# Altium schematic sheet dcdc300_15&Fuente_dual_15V.SchDoc
size A3
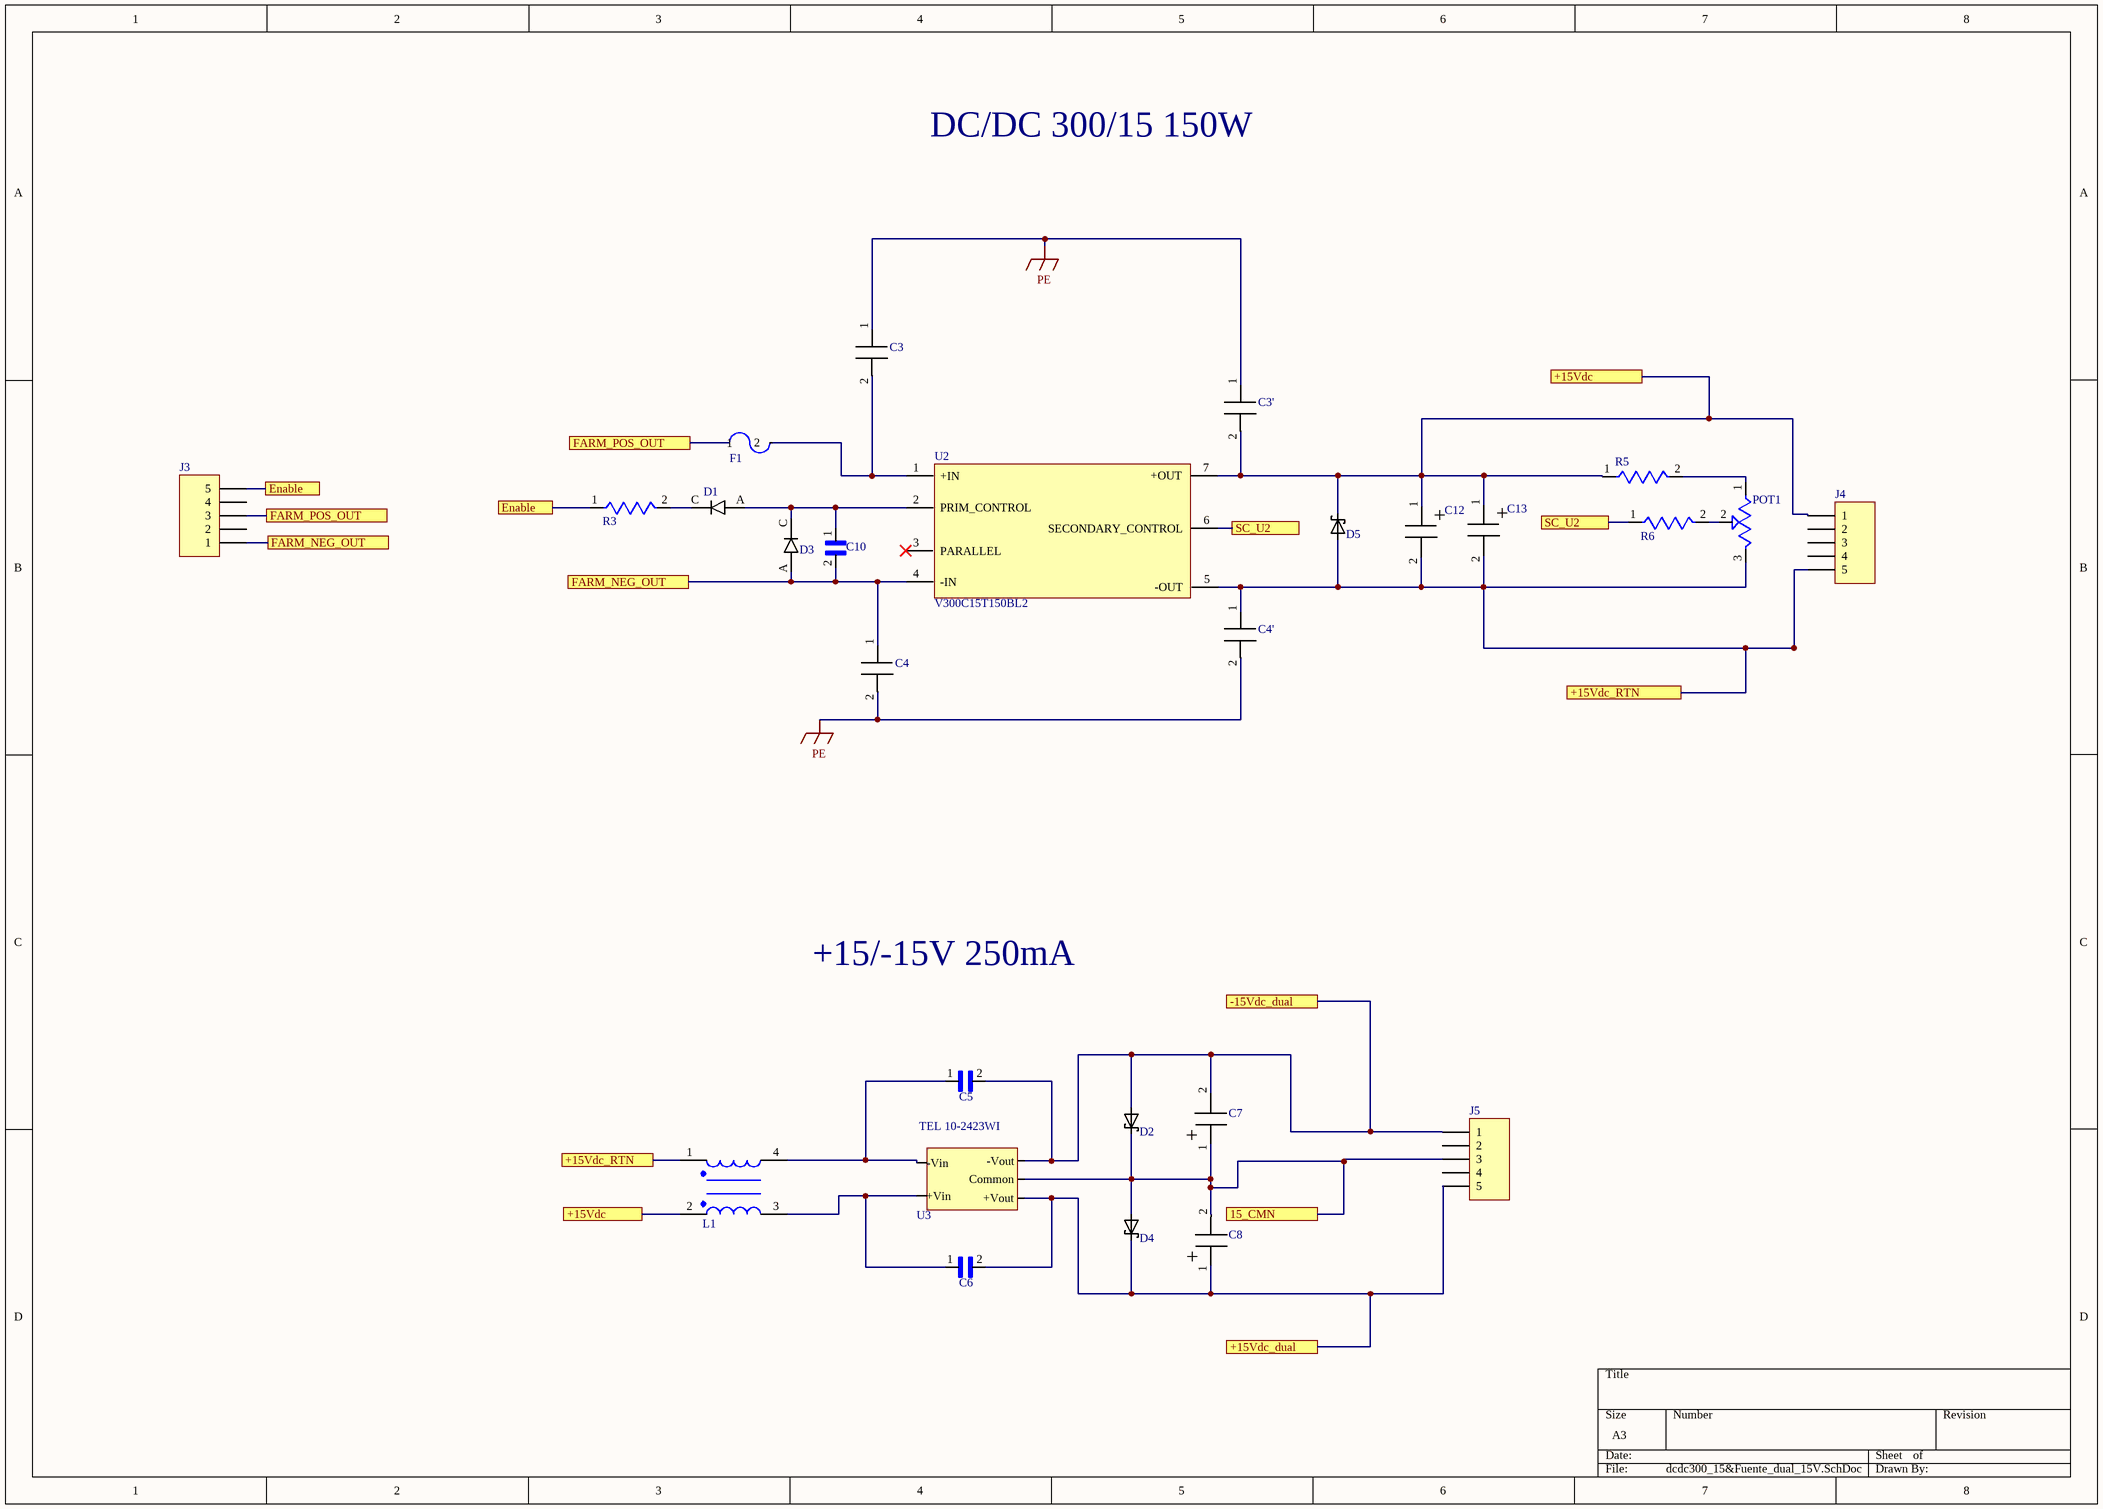
[diagram p0: dcdc300_15&Fuente_dual_15V.SchDoc]

## Parts
C3  01000  [Vicor 01000 Cap]  (value not drawn)
C3'  01000  [Vicor 01000 Cap]  (value not drawn)
C4  01000  [Vicor 01000 Cap]  (value not drawn)
C4'  01000  [Vicor 01000 Cap]  (value not drawn)
C5  1808GA101JAT1A  [MLCC SMD 1808 50V]  (value not drawn)
C6  1808GA101JAT1A  [MLCC SMD 1808 50V]  (value not drawn)
C7  EEE-FK1V100R  [PANASONIC FK SERIES]  (value not drawn)
C8  EEE-FK1V100R  [PANASONIC FK SERIES]  (value not drawn)
C10  UMF105B7102MVHF  [MLCC SMD 0402 50V]  (value not drawn)
C12  EEE-TK1V101P  [Panasonic TK series]  (value not drawn)
C13  EEE-TK1V101P  [Panasonic TK series]  (value not drawn)
D1  1N4006-E3/54  [DO-41]  (value not drawn)
D2  SMCJ15A  [TVS Diode DO-214AB-2 (SMC)]  (value not drawn)
D3  1N5817RLG  [DO-41]  (value not drawn)
D4  SMCJ15A  [TVS Diode DO-214AB-2 (SMC)]  (value not drawn)
D5  SMCJ15A  [TVS Diode DO-214AB-2 (SMC)]  (value not drawn)
F1  BK/PCB-3-R  [PCB-PCD Fuse Eaton]  (value not drawn)
J3  Header 5  [HDR1X5]  (value not drawn)
J4  Header 5  [HDR1X5]  (value not drawn)
J5  Header 5  [HDR1X5]  (value not drawn)
L1  744273222  [744273222]  (value not drawn)
POT1  3296X-1-102LF  [3296W]  (value not drawn)
R3  WHA250FET  [WHA Resistor]  (value not drawn)
R5  MF1/4DC1151F  [KOA MFS1/4 resistors]  (value not drawn)
R6  MF1/4DCT52R9311F  [KOA MF1/4 resistors]  (value not drawn)
U2  V300C15T150BL2  [V300C**T***BL2]
U3  TEL 10-2423WI  [TEL 10-2423WI]

## Ports
15_CMN, +15Vdc, +15Vdc_dual, +15Vdc_RTN, -15Vdc_dual, Enable, FARM_NEG_OUT, FARM_POS_OUT, SC_U2

## Nets
PE: C3.1 C3'.1 C4.2 C4'.2
15_CMN: C7.1 C8.2 D2.C D4.A J5.3 U3.8(Common) ; port 15_CMN
+15Vdc: C3'.2 C12.1 C13.1 D5.C J4.1 L1.2 R5.1(CCW) U2.7(+OUT) ; port +15Vdc
+15Vdc_dual: C6.2 C8.1 D4.C J5.5 U3.9(+Vout) ; port +15Vdc_dual
+15Vdc_RTN: C4'.1 C12.2 C13.2 D5.A J4.5 L1.1 POT1.3(CW) U2.5(-OUT) ; port +15Vdc_RTN
-15Vdc_dual: C5.2 C7.2 D2.A J5.1 U3.10(-Vout) ; port -15Vdc_dual
Enable: J3.5 R3.1(CCW) ; port Enable
FARM_NEG_OUT: C4.1 C10.2 D3.A J3.1 U2.4(-IN) ; port FARM_NEG_OUT
FARM_POS_OUT: F1.1 J3.3 ; port FARM_POS_OUT
SC_U2: R6.1(CCW) U2.6(SECONDARY_CONTROL) ; port SC_U2
NetC3_2: C3.2 F1.2 U2.1(+IN)
NetC5_1: C5.1 L1.4 U3.1(-Vin)
NetC6_1: C6.1 L1.3 U3.16(+Vin)
NetC10_1: C10.1 D1.A D3.C U2.2(PRIM_CONTROL)
NetD1_C: D1.C R3.2(CW)
NetPOT1_1: POT1.1(CCW) R5.2(CW)
NetPOT1_2: POT1.2(WIPER) R6.2(CW)

Not connected (* = marked no-connect by the designer): J3 2 4; J4 2 3 4; J5 2 4; U2 3(PARALLEL)*

## Notes on the sheet
- DC/DC 300/15 150W
- +15/-15V 250mA
- (in symbol Panasonic electrolitic cap) +
- (in symbol Panasonic electrolitic cap FK) +

## Library data of the parts
C3 C3' C4 C4' = Vicor 01000: Cap Film 250Vac 4700pF; ComponentLink1Description: 01000; ComponentLink1URL: https://www.mouser.es/ProductDetail/Vicor/01000?qs=sGAEpiMZZMuWWq7rhECaKfvknpKVOrJMQIoHOM%252Blhgk%3D
C5 C6 = MLCC - SMD 1808: 2KV 100pF C0G 1808 5%; ComponentLink1Description: 1808GA101JAT1A; ComponentLink1URL: https://www.mouser.es/ProductDetail/AVX/1808GA101JAT1A?qs=uXoVb1bFidQW%252BmL544imEA==
C7 C8 = Panasonic electrolitic cap FK: 10uF, 35V; ComponentLink1Description: EEE-FK1V100R; ComponentLink1URL: https://www.mouser.es/ProductDetail/Panasonic/EEE-FK1V100R?qs=%2Fha2pyFaduj%2FIt2M0EHCFH6KCxiBIGyUhvn03lKjROYI3CJTVtBsWg%3D%3D
C10 = MLCC- SMD/SMT: 0402 50V 1000pF 20%; ComponentLink1Description: UMF105B7102MVHF; ComponentLink1URL: https://www.mouser.es/ProductDetail/Taiyo-Yuden/UMF105B7102MVHF?qs=sGAEpiMZZMsh%252B1woXyUXj3%2F0vCYPokIksdT%252B3UPAP3Y%3D
C12 C13 = Panasonic electrolitic cap: 100uF, 35Vdc; ComponentLink1Description: EEE-TK1V101P; ComponentLink1URL: https://www.mouser.es/ProductDetail/Panasonic/EEE-TK1V101P?qs=sGAEpiMZZMtZ1n0r9vR22cS6GEbW2ftohEDRFgYA5M4%3D
D1 = Diodo Standard: Rectificadores Vr/800V Io/1A; ComponentLink1Description: 1N4006-E3/54; ComponentLink1URL: https://www.mouser.es/ProductDetail/Vishay-Semiconductors/1N4006-E3-54?qs=N4vtoAxH%2FSrsleYv417wqA%3D%3D
D2 D4 D5 = TVS SMCJxxA: SMC do-214AB-2; ComponentLink1Description: SMCJ15A; ComponentLink1URL: https://www.mouser.es/ProductDetail/Taiwan-Semiconductor/SMCJ15A?qs=sGAEpiMZZMvxHShE6Whpu8fatLI1nnJdRhHnBKQQd%2F4%3D
D3 = Diodo Standard: Diodos y rectificadores Schottky 1A 20V; ComponentLink1Description: 1N5817RLG; ComponentLink1URL: https://www.mouser.es/ProductDetail/ON-Semiconductor/1N5817RLG?qs=sGAEpiMZZMtQ8nqTKtFS%2FCKUxMvjsmGzOxc2t8Io3Tc%3D
F1 = PCB-PCD  Fuse: 3A, 250VAC; ComponentLink1Description: BK/PCB-3-R; ComponentLink1URL: https://www.mouser.es/ProductDetail/Bussmann-Eaton/BK-PCB-3-R?qs=sGAEpiMZZMsNIlwy3aAdUaDZNJYRjnIOAIrCwmRP80U%3D
J3-J5 = Header 5: Header, 5-Pin; LatestRevisionDate: 17-Jul-2002; LatestRevisionNote: Re-released for DXP Platform.; Publisher: Altium Limited
L1 = 744273222: CMC 30UH 1.4A 2LN 2.2 KOHM SMD; ComponentLink1Description: Datasheet; ComponentLink1URL: https://www.we-online.de/katalog/datasheet/744273222.pdf; ComponentLink2Description: 744273222; ComponentLink2URL: https://www.digikey.com/product-detail/en/w%C3%BCrth-elektronik/744273222/732-2961-2-ND/2625900
POT1 = 3296W: 1kOhm; ComponentLink1Description: 3296W; ComponentLink1URL: https://www.mouser.es/ProductDetail/Bourns/3296X-1-102LF?qs=sGAEpiMZZMvygUB3GLcD7sSg8po3Zpo39j0IRAy8iUQ%3D
R3 = Resistor bobinado: 0.5W 250 ohms 1%; ComponentLink1Description: WHA250FET; ComponentLink1URL: https://www.mouser.es/ProductDetail/Ohmite/WHA250FET?qs=sGAEpiMZZMtlubZbdhIBICsIiTQa2nvcChJCFP%2FmfdI%3D
R5 = KOA MFS1/4 resistors: 1,15kOhm; ComponentLink1Description: MF1/4DC1151F; ComponentLink1URL: https://www.mouser.es/ProductDetail/KOA-Speer/MF1-4DC1151F?qs=sGAEpiMZZMu61qfTUdNhG7WeLdaRvH9A9PYBQZY3Jro%3D
R6 = KOA MF1/4 resistors: 9.28kOhm; ComponentLink1Description: MF1/4DCT52R9311F; ComponentLink1URL: https://www.mouser.es/ProductDetail/KOA-Speer/MF1-4DCT52R9311F?qs=sGAEpiMZZMu61qfTUdNhG%2FDQawzJ6c7PvJQ3koAyQBI%3D
U2 = V300C**T***BL2: DC/DC converter Micro Family; ComponentLink1Description: Vicor; ComponentLink1URL: http://www.vicorpower.com/dc-dc-converters-board-mount/high-density-dc-dc-converters; ComponentLink2Description: V300C15T150BL2; ComponentLink2URL: https://www.mouser.es/ProductDetail/Vicor/V300C15T150BL2?qs=%2Fha2pyFaduiLhIankBTTmZKrPSIILbrL8nAz3AoioOOMymv1LXbubw%3D%3D
U3 = TEL 10WI Series: TEL 10WI series is a range of isolated 10 Watt converters which come in / an ultra compact DIP-16; ComponentLink1Description: TEL 10WI Series; ComponentLink1URL: https://www.tracopower.com/sites/default/files/products/datasheets/tel10wi_datasheet.pdf; ComponentLink2Description: TEL 10-2423WI; ComponentLink2URL: https://www.mouser.es/ProductDetail/TRACO-Power/TEL-10-2423WI?qs=y6ZabgHbY%252Bwg%252BI3%252Bdy9OqQ%3D%3D